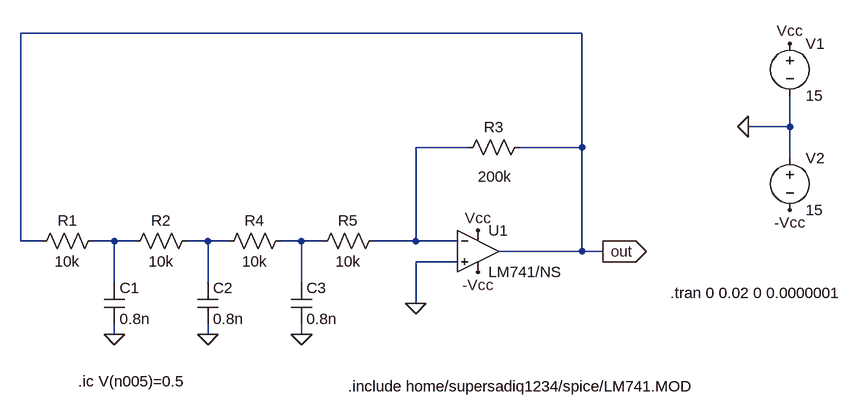
[diagram p0: schematic ee18btech11051_spice1.asc]
ee18btech11051_spice1.asc, the LTspice schematic file:
Version 4
SHEET 1 1280 680
WIRE 368 -304 -496 -304
WIRE 688 -160 688 -208
WIRE 688 -160 624 -160
WIRE 192 -128 112 -128
WIRE 368 -128 368 -304
WIRE 368 -128 272 -128
WIRE 688 -112 688 -160
WIRE -496 16 -496 -304
WIRE -464 16 -496 16
WIRE -352 16 -384 16
WIRE -320 16 -352 16
WIRE -208 16 -240 16
WIRE -176 16 -208 16
WIRE -64 16 -96 16
WIRE -32 16 -64 16
WIRE 112 16 112 -128
WIRE 112 16 48 16
WIRE 176 16 112 16
WIRE 368 32 368 -128
WIRE 368 32 240 32
WIRE 400 32 368 32
WIRE 176 48 112 48
WIRE -352 80 -352 16
WIRE -208 80 -208 16
WIRE -64 80 -64 16
WIRE 112 112 112 48
WIRE -352 160 -352 144
WIRE -208 160 -208 144
WIRE -64 160 -64 144
FLAG 688 -288 Vcc
FLAG 688 -32 -Vcc
FLAG 208 0 Vcc
FLAG 208 64 -Vcc
FLAG -352 160 0
FLAG -208 160 0
FLAG 112 112 0
FLAG 400 32 out
IOPIN 400 32 Out
FLAG 624 -160 0
FLAG -64 160 0
SYMBOL voltage 688 -304 R0
WINDOW 123 0 0 Left 0
WINDOW 39 0 0 Left 0
SYMATTR InstName V1
SYMATTR Value 15
SYMBOL voltage 688 -128 R0
WINDOW 123 0 0 Left 0
WINDOW 39 0 0 Left 0
SYMATTR InstName V2
SYMATTR Value 15
SYMBOL res 288 -144 R90
WINDOW 0 0 56 VBottom 2
WINDOW 3 45 54 VTop 2
SYMATTR InstName R3
SYMATTR Value 200k
SYMBOL res -368 0 R90
WINDOW 0 0 56 VBottom 2
WINDOW 3 32 56 VTop 2
SYMATTR InstName R1
SYMATTR Value 10k
SYMBOL res -224 0 R90
WINDOW 0 0 56 VBottom 2
WINDOW 3 32 56 VTop 2
SYMATTR InstName R2
SYMATTR Value 10k
SYMBOL res -80 0 R90
WINDOW 0 0 56 VBottom 2
WINDOW 3 32 56 VTop 2
SYMATTR InstName R4
SYMATTR Value 10k
SYMBOL res 64 0 R90
WINDOW 0 0 56 VBottom 2
WINDOW 3 32 56 VTop 2
SYMATTR InstName R5
SYMATTR Value 10k
SYMBOL cap -368 80 R0
SYMATTR InstName C1
SYMATTR Value 0.8n
SYMBOL cap -224 80 R0
SYMATTR InstName C2
SYMATTR Value 0.8n
SYMBOL cap -80 80 R0
SYMATTR InstName C3
SYMATTR Value 0.8n
SYMBOL OpAmps\\opamp2 208 -32 R0
SYMATTR InstName U1
SYMATTR Value LM741/NS
TEXT 504 96 Left 2 !.tran 0 0.02 0 0.0000001
TEXT 8 240 Left 2 !.include home/supersadiq1234/spice/LM741.MOD
TEXT -408 232 Left 2 !.ic V(n005)=0.5

The netlist it stands for:
* ee18btech11051_spice1.asc
V1 Vcc 0 15
V2 0 -Vcc 15
R3 out N001 200k
R1 N002 out 10k
R2 N003 N002 10k
R4 N004 N003 10k
R5 N001 N004 10k
C1 N002 0 0.8n
C2 N003 0 0.8n
C3 N004 0 0.8n
XU1 0 N001 Vcc -Vcc out LM741/NS  ; pins In+ In- V+ V- OUT
.tran 0 0.02 0 0.0000001
.include home/supersadiq1234/spice/LM741.MOD
.ic V(n005)=0.5
.backanno
.end